# EAGLE design Enabled-Controller (EAGLE 9.6.2)
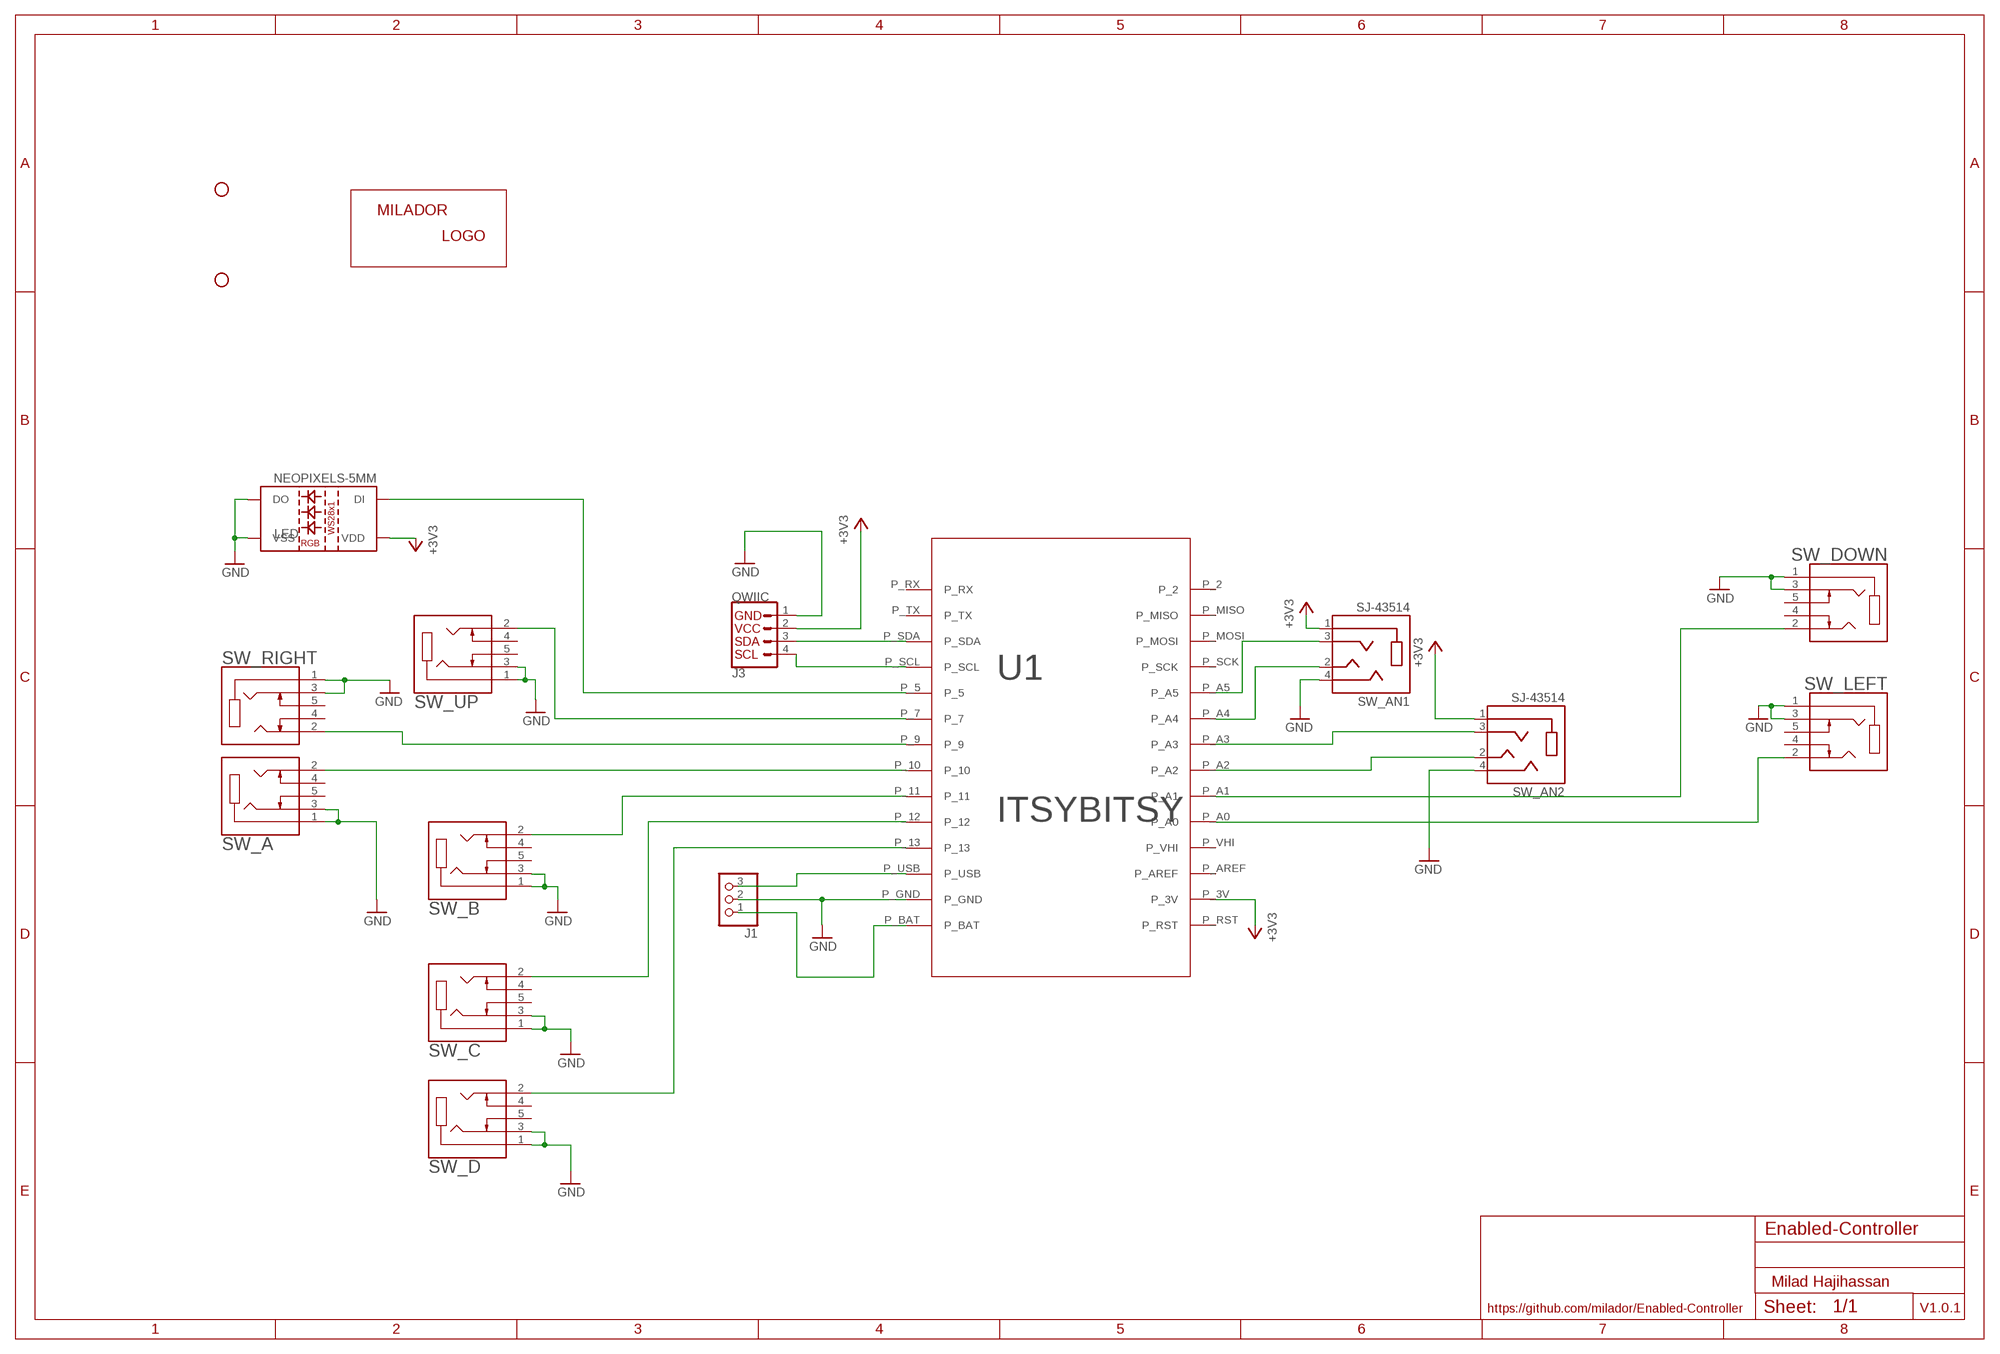
[diagram p0: schematic, sheet 1]

## Parts
J1  HEADER_FEMALE-1X3-LONGER  [HEADER_FEMALE-1X03_LONGER]
J3  QWIIC  QWIIC_CONNECTORSJS-1MM  [CONNECTORS_JST04_1MM_RA]
LABEL1  MILADOR-LOGO-  [MILADOR_LOGO1]
LED  NEOPIXELS-5MM  [NEOPIXELS-5MM]
STANDOFF1  STAND-OFF-  [STAND-OFF]
STANDOFF2  STAND-OFF-  [STAND-OFF]
SW_A  CUI_SJ1-3535NGSJ1-3535NG  [CUI_SJ1-3535NG]
SW_AN1  SJ-43514  [CUI_SJ-43514]
SW_AN2  SJ-43514  [CUI_SJ-43514]
SW_B  CUI_SJ1-3535NGSJ1-3535NG  [CUI_SJ1-3535NG]
SW_C  CUI_SJ1-3535NGSJ1-3535NG  [CUI_SJ1-3535NG]
SW_D  CUI_SJ1-3535NGSJ1-3535NG  [CUI_SJ1-3535NG]
SW_DOWN  CUI_SJ1-3535NGSJ1-3535NG  [CUI_SJ1-3535NG]
SW_LEFT  CUI_SJ1-3535NGSJ1-3535NG  [CUI_SJ1-3535NG]
SW_RIGHT  CUI_SJ1-3535NGSJ1-3535NG  [CUI_SJ1-3535NG]
SW_UP  CUI_SJ1-3535NGSJ1-3535NG  [CUI_SJ1-3535NG]
U1  ITSYBITSY  ITSYBITSY-V2  [ITSYBITSY-V2]

## Nets
+3V3: J3.2 LED.P2(VDD) SW_AN1.1(SLEEVE) SW_AN2.1(SLEEVE) U1.P_3V
GND: J1.2 J3.1 LED.P3(VSS) LED.P4(DO) SW_A.1 SW_A.3 SW_AN1.4(RING2) SW_AN2.4(RING2) SW_B.1 SW_B.3 SW_C.1 SW_C.3 SW_D.1 SW_D.3 SW_DOWN.1 SW_DOWN.3 SW_LEFT.1 SW_LEFT.3 SW_RIGHT.1 SW_RIGHT.3 SW_UP.1 SW_UP.3 U1.P_GND
N$1: SW_D.2 U1.P_13
N$2: SW_C.2 U1.P_12
N$3: SW_B.2 U1.P_11
N$4: SW_AN1.2(TIP) U1.P_A4
N$5: SW_DOWN.2 U1.P_A1
N$6: SW_RIGHT.2 U1.P_9
N$7: SW_UP.2 U1.P_7
N$8: SW_AN1.3(RING1) U1.P_A5
N$9: SW_AN2.3(RING1) U1.P_A3
N$10: SW_A.2 U1.P_10
N$11: SW_LEFT.2 U1.P_A0
N$12: SW_AN2.2(TIP) U1.P_A2
N$13: LED.P1(DI) U1.P_5
N$14: J3.4 U1.P_SCL
N$15: J3.3 U1.P_SDA
N$16: J1.3 U1.P_USB
N$17: J1.1 U1.P_BAT
Unconnected: SW_A.4 SW_A.5 SW_B.4 SW_B.5 SW_C.4 SW_C.5 SW_D.4 SW_D.5 SW_DOWN.4 SW_DOWN.5 SW_LEFT.4 SW_LEFT.5 SW_RIGHT.4 SW_RIGHT.5 SW_UP.4 SW_UP.5 U1.P_2 U1.P_AREF U1.P_MISO U1.P_MOSI U1.P_RST U1.P_RX U1.P_SCK U1.P_TX U1.P_VHI

## Notes on the sheet
- Milad Hajihassan
- https://github.com/milador/Enabled-Controller | V1.0.1

## Library data of the parts
J1 = milador:HEADER_FEMALE-1X3-LONGER: PIN HEADER
J3 = milador_SMD:QWIIC_CONNECTORS: SparkFun I2C Standard Qwiic Connector An SMD 1mm pitch JST connector makes it easy and quick (get it? Qwiic?) to connect I2C devices to each other. The Qwiic system <http://www.sparkfun.com/qwiic> enables fast and solderless connection between popular platforms and various sensors and actuators. We carry 200mm <https://www.sparkfun.com/products/14204>, 100mm <https://www.sparkfun.com/products/14205>, 50mm <https://www.sparkfun.com/products/14206>, and breadboard friendly <https://www.sparkfun.com/products/14207> Qwiic cables. We also offer 10 pcs strips <https://www.sparkfun.com/products/14323> the SMD connectors.; PROD_ID: CONN-13694; VALUE: QWIIC_RIGHT_ANGLE
LABEL1 = milador:MILADOR-LOGO-
LED = MMC Eagle:NEOPIXELS-5MM
STANDOFF1 STANDOFF2 = MMC Eagle:STAND-OFF-
SW_A SW_B SW_C SW_D SW_DOWN SW_LEFT SW_RIGHT SW_UP = MMC Eagle:CUI_SJ1-3535NG
SW_AN1 SW_AN2 = MMC Eagle:SJ-43514
U1 = MMC Eagle:ITSYBITSY-V2

## Net classes
0 GND: clearance 0.205 mm
2 GND2: clearance 0.205 mm to class 0, clearance 0.205 mm to class 1, clearance 0.205 mm
3 GND3: clearance 0.205 mm to class 0, clearance 0.205 mm to class 1, clearance 0.205 mm to class 2, clearance 0.205 mm

## Board
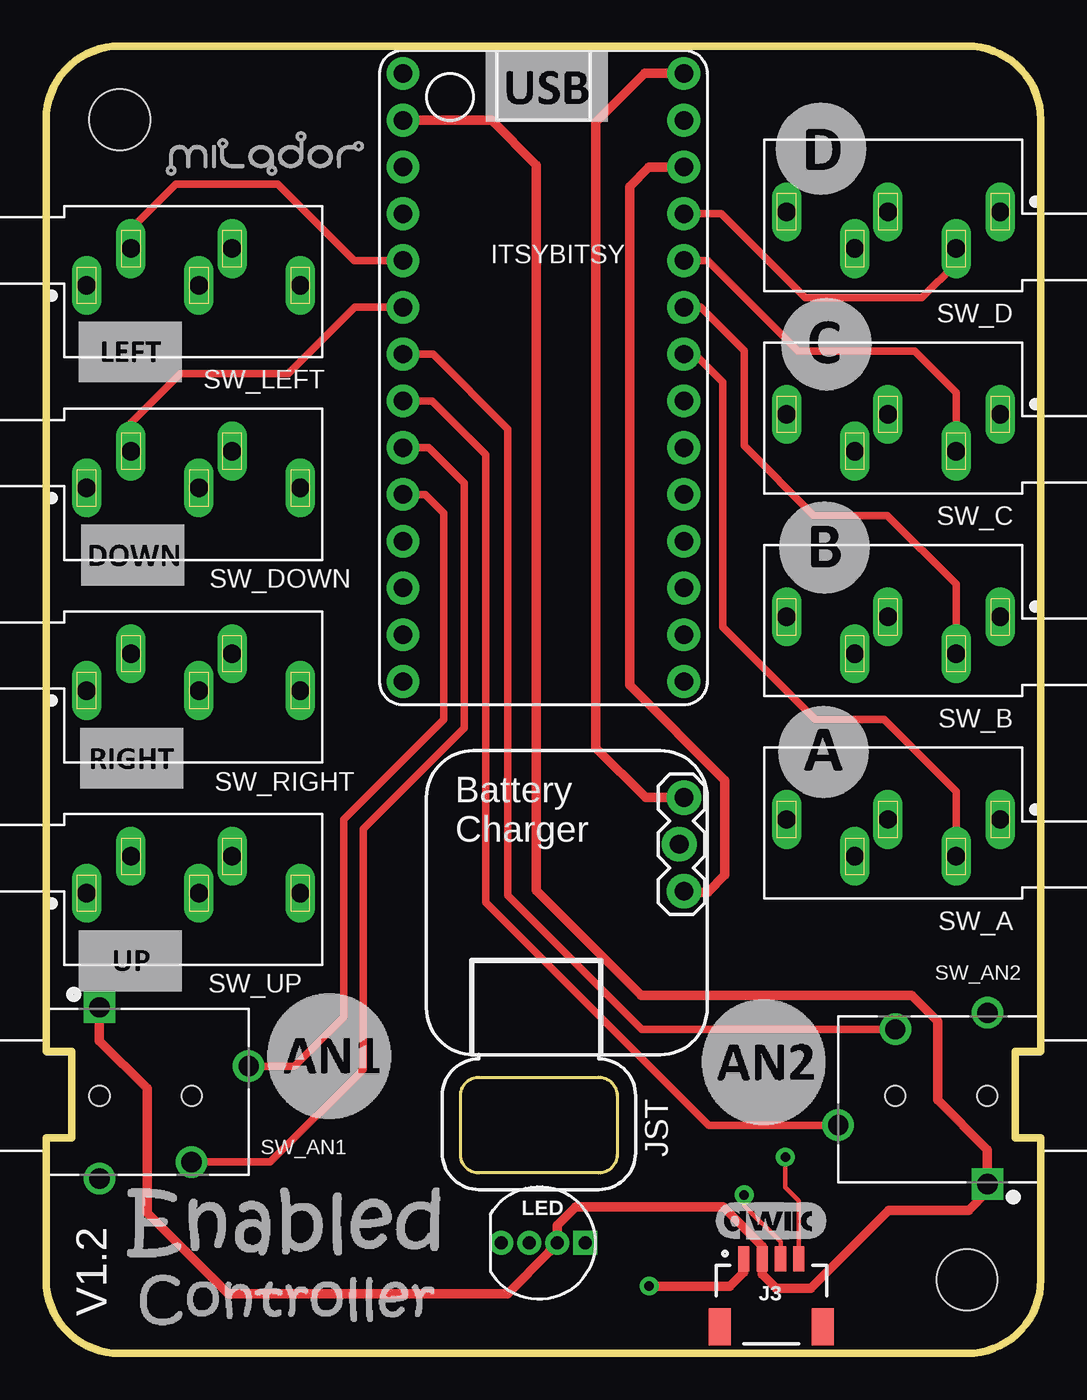
[diagram p1: board, top side]
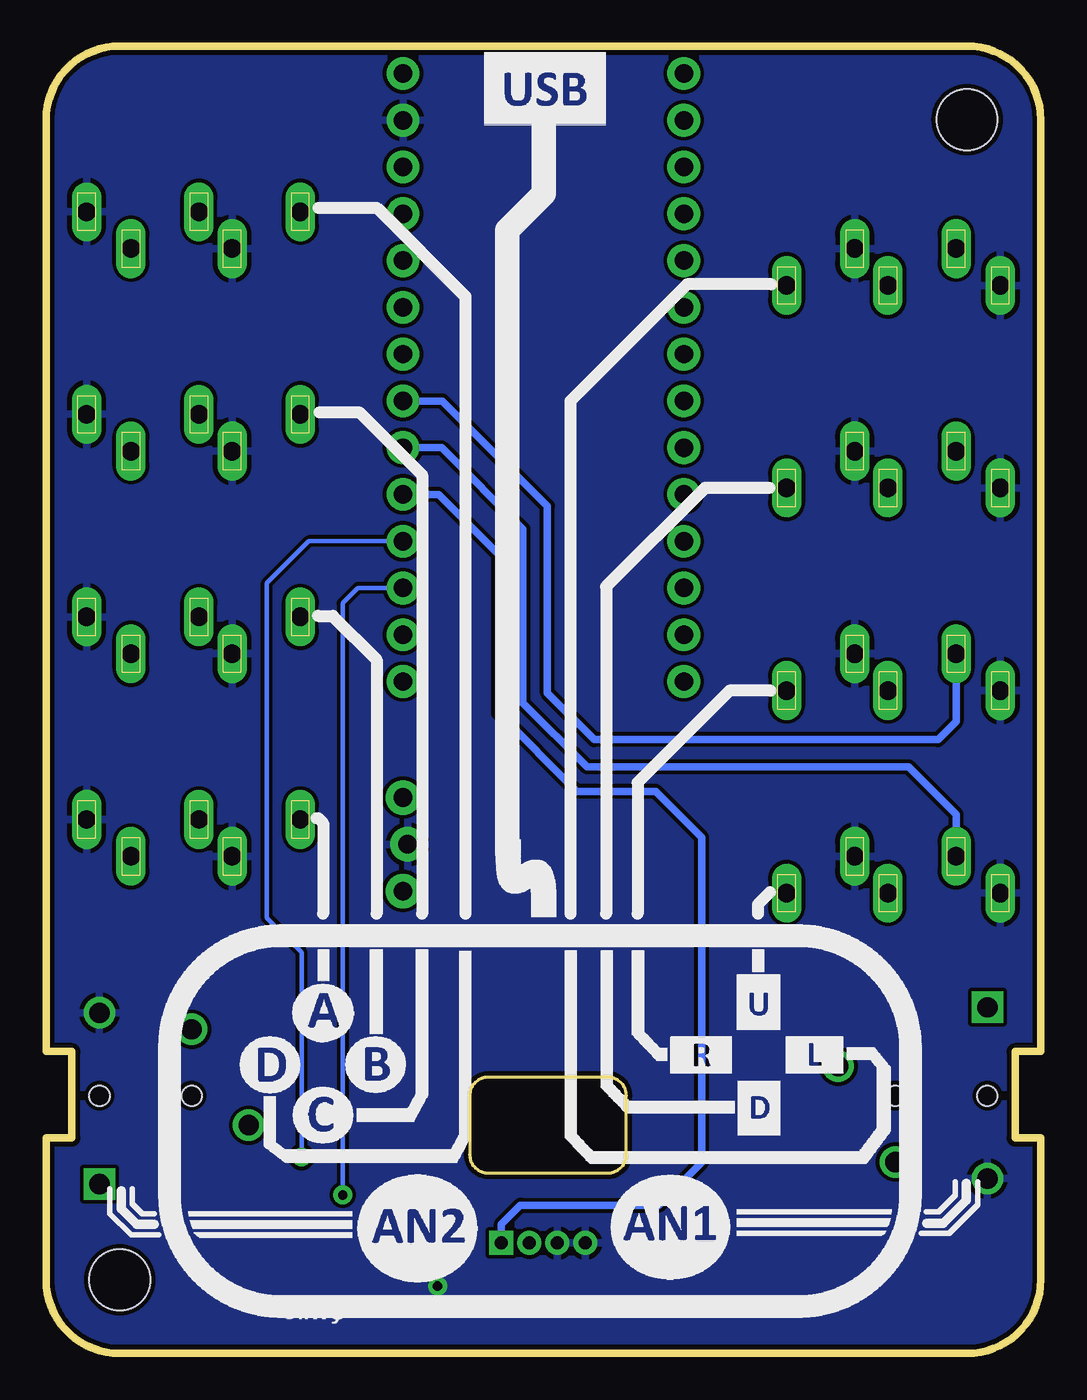
[diagram p2: board, bottom side, seen from below]

Size 54 x 71 mm. Coordinates in mm from the lower left corner, seen from the top.
Outline: 4,0 50,0 arc90 54,4 54,11.7 52.6,11.7 52.6,16.4 54,16.4 54,67 arc90 50,71 4,71 arc90 0,67 0,16.4 1.4,16.4 1.4,11.7 0,11.7 0,4 arc90 4,0
Outline: 23.5,9.8 arc-90 22.5,10.8 22.5,14 arc-90 23.5,15 30,15 arc-90 31,14 31,10.8 arc-90 30,9.8 23.5,9.8
Copper layers (1*16): Top 0.035mm / dielectric 1.5mm / Bottom 0.035mm
Design rules "SparkFun": minimum track width 8mil, minimum drill 20mil, track to track 8mil, track to pad 8mil, pad to pad 8mil, via to via 8mil, smd to smd 8mil, copper to edge 10mil, drill to drill 8mil, minimum pad ring 12mil, minimum via ring 10mil, stop-mask expansion 4mil, vias tented up to drill 25mil, thermal gap 10mil

### Footprints (pad centres in the part's own frame; a part is rotated, then mirrored left to right if it is on the bottom)
HEADER_FEMALE-1X03_LONGER = drill 1.016 pad 1.88: 1 0,0.127; 2 2.54,-0.127; 3 5.08,0.127
CONNECTORS_JST04_1MM_RA = smd 0.6 x 1.35: 1 -1.5,0; 2 -0.5,0; 3 0.5,0; 4 1.5,0 | smd 1.2 x 2: NC1 2.8,-3.675; NC2 -2.8,-3.675
NEOPIXELS-5MM = drill 0.7 pad 1.016 square: P1 2.28,0 | drill 0.7 pad 1.016: P2 0.76,0; P3 -0.76,0; P4 -2.28,0
STAND-OFF = hole 3.302: 0,0
CUI_SJ1-3535NG = drill 1 long: 1 0,0; 2 2.4,2; 3 7.9,2; 4 11.6,0; 5 6.1,0
CUI_SJ-43514 = drill 1.1 square: 1 -2.6,4.8 | drill 1.1: 2 2.4,-3.6; 3 5.5,1.6; 4 -2.6,-4.5 | hole 1.1: -2.6,0; 2.4,0
ITSYBITSY-V2 = drill 1 pad 1.778: P_2 7.62,16.51; P_3V 7.62,-13.97; P_5 -7.62,6.35; P_7 -7.62,3.81; P_9 -7.62,1.27; P_10 -7.62,-1.27; P_11 -7.62,-3.81; P_12 -7.62,-6.35; P_13 -7.62,-8.89; P_A0 7.62,-6.35; P_A1 7.62,-3.81; P_A2 7.62,-1.27; P_A3 7.62,1.27; P_A4 7.62,3.81; P_A5 7.62,6.35; P_AREF 7.62,-11.43; P_BAT -7.62,-16.51; P_GND -7.62,-13.97; P_MISO 7.62,13.97; P_MOSI 7.62,11.43; P_RST 7.62,-16.51; P_RX -7.62,16.51; P_SCK 7.62,8.89; P_SCL -7.62,8.89; P_SDA -7.62,11.43; P_TX -7.62,13.97; P_USB -7.62,-11.43; P_VHI 7.62,-8.89

### Placement (x,y rotation side)
J1  34.5,30.19 270 top
J3  39.37,5.13 0 top
LABEL1  12,64 0 top
LABEL2  [QWIIC_6MM]  39.4,7.19 0 top
LED  27,6 0 top
STANDOFF1  50,4 0 top
STANDOFF2  4,67 0 top
SW_A  51.8,29 180 top
SW_AN1  5.5,14 0 top
SW_AN2  48.5,14 180 top
SW_B  51.8,40 180 top
SW_C  51.8,51 180 top
SW_D  51.8,62 180 top
SW_DOWN  2.2,47 0 top
SW_LEFT  2.2,58 0 top
SW_RIGHT  2.2,36 0 top
SW_UP  2.2,25 0 top
U1  27,53 180 top

### Tracks (layer width: path | path; a pad name or v marks a point on that pad's centre or on a via)
+3V3
  Top 0.508: U1.P_3V 24.19,66.97 26.62,64.54 26.62,25.14 32.32,19.44 46.99,19.44 48.41,18.02 48.41,13.76 51.1,11.07 SW_AN2.1 51.1,8.8 50.08,7.78 45.74,7.78 41.5,3.55 39.63,3.55 38.87,4.31 J3.2 38.88,5.15 38.88,5.82 36.75,7.95 28.75,7.95 27.76,6.96 LED.P2 27.35,5.59 27.35,5.54 25.06,3.24 9.88,3.24 5.48,7.64 5.48,14.4 2.9,16.98 SW_AN1.1
GND  (via drill 0.51)
  Top 0.508: v32.74,3.66 37.11,3.66 37.87,4.42 J3.1
  pour Bottom: 4,0 50,0 arc90 54,4 54,67 arc90 50,71 4,71 arc90 0,67 0,4 arc90
N$1
  Top 0.406: SW_D.2 49.4,59.18 47.55,57.33 41.2,57.33 36.64,61.89 U1.P_13
N$2
  Top 0.406: SW_C.2 49.4,52.18 47.15,54.43 40.85,54.43 35.93,59.35 U1.P_12
N$3
  Top 0.406: SW_B.2 49.4,41.78 45.67,45.51 41.68,45.51 37.9,49.29 37.9,54.46 35.55,56.81 U1.P_11
N$4
  Top 0.406: SW_AN1.2 12.18,10.4 17.22,15.44 17.22,28.49 22.7,33.97 22.7,47.26 20.77,49.19 U1.P_A4
N$5
  Top 0.406: SW_DOWN.2 4.6,50.53 7.29,53.22 13.16,53.22 16.75,56.81 U1.P_A1
N$6
  Bottom 0.406: SW_RIGHT.2 4.6,34.31 5.57,33.34 24.25,33.34 26.78,35.87 26.78,46.03 32.48,51.73 U1.P_9
N$7
  Bottom 0.406: SW_UP.2 4.6,29.28 7.17,31.85 24.63,31.85 28.11,35.33 28.11,44.78 32.52,49.19 U1.P_7
N$8
  Top 0.406: SW_AN1.3 13.48,15.6 16.16,18.28 16.16,29 21.59,34.43 21.59,45.64 20.58,46.65 U1.P_A5
N$9
  Top 0.406: SW_AN2.3 35.96,12.4 23.88,24.49 23.88,48.82 20.97,51.73 U1.P_A3
N$10
  Top 0.406: SW_A.2 49.4,30.52 45.5,34.42 41.76,34.42 36.73,39.45 36.73,52.75 35.21,54.27 U1.P_10
N$11
  Top 0.406: U1.P_A0 16.73,59.35 12.59,63.49 7.04,63.49 4.6,61.05 SW_LEFT.2
N$12
  Top 0.406: SW_AN2.2 32.33,17.6 25.07,24.86 25.07,50.21 21.01,54.27 U1.P_A2
N$13
  Bottom 0.406: U1.P_5 32.69,46.65 29.43,43.4 29.43,34.77 25.19,30.53 20.91,30.53 18.41,28.03 18.41,10.37 20.73,8.05 28.25,8.05 29.28,7.02 LED.P1
N$14  (via drill 0.51)
  Top 0.254: v40.13,10.67 40.13,9.02 40.87,8.28 J3.4
  Bottom 0.254: U1.P_SCL 39.73,44.11 42.01,41.83 42.01,23.65 40.13,21.77 v40.13,10.67
N$15  (via drill 0.51)
  Top 0.254: J3.3 39.87,6.05 37.9,8.03 v37.9,8.61
  Bottom 0.254: U1.P_SDA 37.07,41.57 37.9,40.74 v37.9,8.61
N$16
  Top 0.508: U1.P_USB 32.73,64.43 31.67,63.37 31.67,36.3 36.85,31.11 36.85,25.98 35.92,25.04 34.69,25.04 J1.3
N$17
  Top 0.508: U1.P_BAT 32.5,69.51 29.84,66.85 29.84,32.89 32.55,30.19 J1.1

### Text on the board
tPlace: Battery / Charger | JST | V1.2